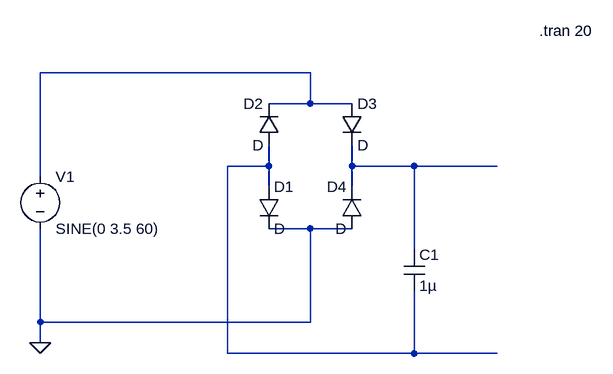
[diagram p0: schematic bridge_rectifier.asc]
bridge_rectifier.asc, the LTspice schematic file:
Version 4
SHEET 1 940 680
WIRE 496 160 80 160
WIRE 496 208 496 160
WIRE 496 208 432 208
WIRE 560 208 496 208
WIRE 432 304 432 272
WIRE 432 304 368 304
WIRE 560 304 560 272
WIRE 656 304 560 304
WIRE 784 304 656 304
WIRE 80 320 80 160
WIRE 432 336 432 304
WIRE 560 336 560 304
WIRE 496 400 432 400
WIRE 560 400 496 400
WIRE 656 432 656 304
WIRE 80 544 80 400
WIRE 496 544 496 400
WIRE 496 544 80 544
WIRE 80 576 80 544
WIRE 368 592 368 304
WIRE 656 592 656 496
WIRE 656 592 368 592
WIRE 784 592 656 592
FLAG 80 576 0
SYMBOL Voltage 80 304 R0
SYMATTR InstName V1
SYMATTR Value SINE(0 3.5 60)
SYMBOL Diode 416 336 R0
SYMATTR InstName D1
SYMBOL Diode 448 272 R180
WINDOW 0 24 64 Left 2
WINDOW 3 24 0 Left 2
SYMATTR InstName D2
SYMBOL Diode 544 208 R0
SYMATTR InstName D3
SYMBOL Diode 576 400 R180
WINDOW 0 24 64 Left 2
WINDOW 3 24 0 Left 2
SYMATTR InstName D4
SYMBOL Cap 640 432 R0
SYMATTR InstName C1
SYMATTR Value 1µ
TEXT 848 96 Left 2 !.tran 20

The netlist it stands for:
* bridge_rectifier.asc
V1 N001 0 SINE(0 3.5 60)
D1 N002 0 D
D2 N002 N001 D
D3 N001 N003 D
D4 0 N003 D
C1 N003 N002 1µ
.model D D
.lib standard.dio
.tran 20
.backanno
.end